# EAGLE design rf9.1 (EAGLE 7.4.0)
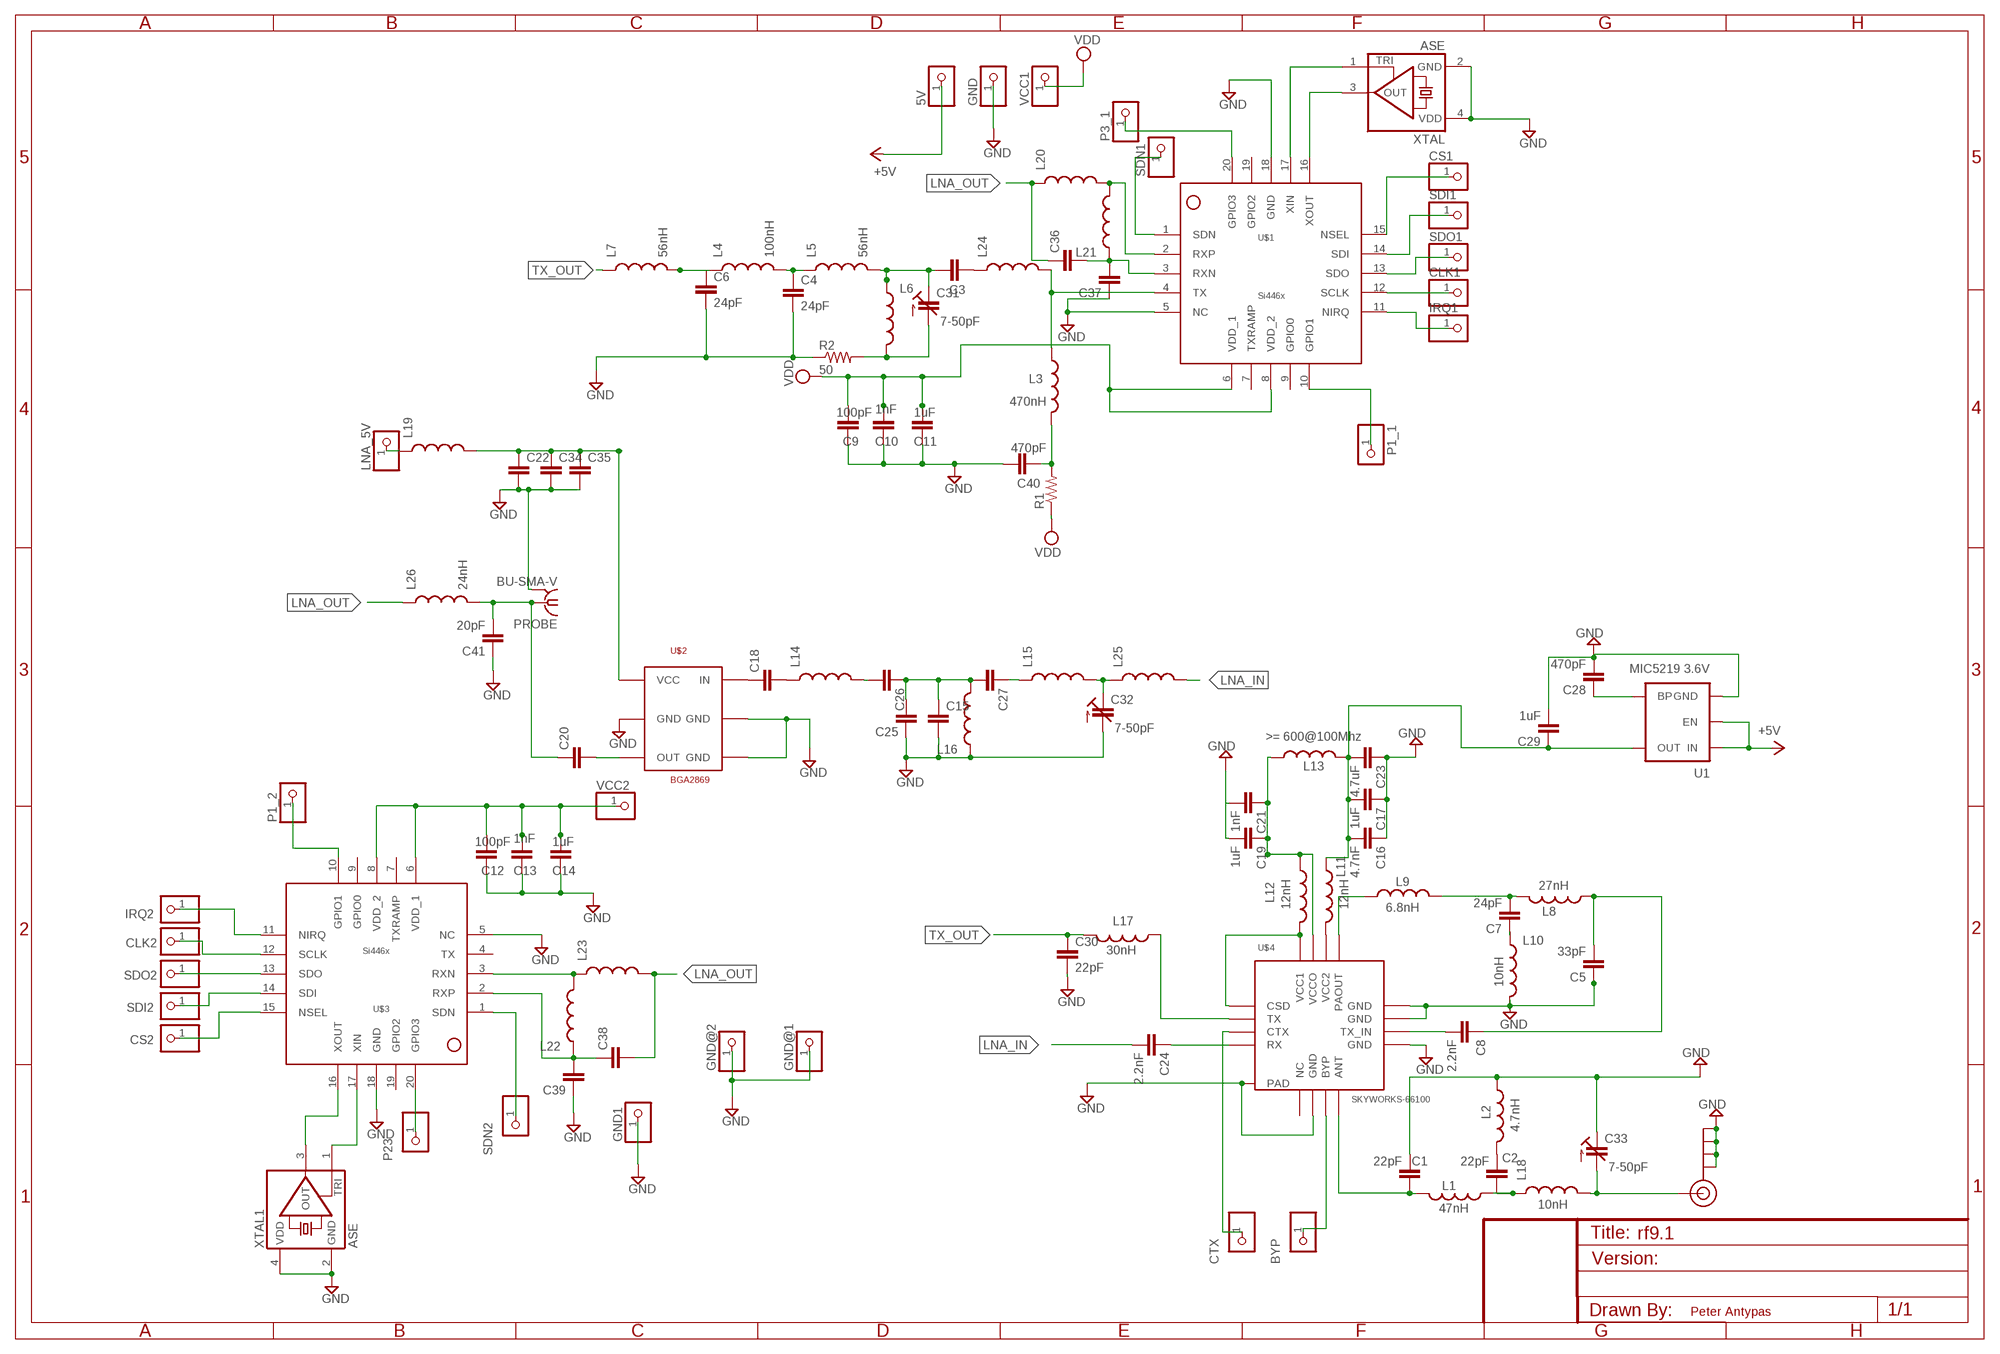
[diagram p0: schematic, sheet 1]

## Parts
5V  PINHD-1X1  [1X01]
BYP  PINHD-1X1  [1X01]
C1  22pF  CAP0603-CAP  [0603-CAP]
C2  22pF  CAP0603-CAP  [0603-CAP]
C3  CAP0603-CAP  [0603-CAP]
C4  24pF  CAP0603-CAP  [0603-CAP]
C5  33pF  CAP0603-CAP  [0603-CAP]
C6  24pF  CAP0603-CAP  [0603-CAP]
C7  24pF  CAP0603-CAP  [0603-CAP]
C8  2.2nF  CAP0603-CAP  [0603-CAP]
C9  100pF  CAP0603-CAP  [0603-CAP]
C10  1nF  CAP0603-CAP  [0603-CAP]
C11  1uF  CAP0603-CAP  [0603-CAP]
C12  100pF  CAP0603-CAP  [0603-CAP]
C13  1nF  CAP0603-CAP  [0603-CAP]
C14  1uF  CAP0603-CAP  [0603-CAP]
C15  CAP0603-CAP  [0603-CAP]
C16  4.7nF  CAP0805  [0805]
C17  1uF  CAP0805  [0805]
C18  CAP0805  [0805]
C19  1uF  CAP0805  [0805]
C20  CAP0805  [0805]
C21  1nF  CAP0805  [0805]
C22  CAP0603-CAP  [0603-CAP]
C23  4.7uF  CAP0805  [0805]
C24  2.2nF  CAP0805  [0805]
C25  CAP0603-CAP  [0603-CAP]
C26  CAP0603-CAP  [0603-CAP]
C27  CAP0603-CAP  [0603-CAP]
C28  470pF  CAP0603-CAP  [0603-CAP]
C29  1uF  CAP0805  [0805]
C30  22pF  CAP0603-CAP  [0603-CAP]
C31  7-50pF  C-TRIMMTZBX4  [CTRIMTZBX4]
C32  7-50pF  C-TRIMMTZBX4  [CTRIMTZBX4]
C33  7-50pF  C-TRIMMTZBX4  [CTRIMTZBX4]
C34  CAP0603-CAP  [0603-CAP]
C35  CAP0603-CAP  [0603-CAP]
C36  CAP0603-CAP  [0603-CAP]
C37  CAP0603-CAP  [0603-CAP]
C38  CAP0603-CAP  [0603-CAP]
C39  CAP0603-CAP  [0603-CAP]
C40  470pF  CAP0603-CAP  [0603-CAP]
C41  20pF  CAP0603-CAP  [0603-CAP]
CLK1  PINHD-1X1  [1X01]
CLK2  PINHD-1X1  [1X01]
CS1  PINHD-1X1  [1X01]
CS2  PINHD-1X1  [1X01]
CTX  PINHD-1X1  [1X01]
GND  PINHD-1X1  [1X01]
GND1  PINHD-1X1  [1X01]
GND@1  PINHD-1X1  [1X01]
GND@2  PINHD-1X1  [1X01]
IRQ1  PINHD-1X1  [1X01]
IRQ2  PINHD-1X1  [1X01]
J$1  SMA_EDGE  [SMA-EDGE]
L1  47nH  INDUCTOR30OHM,1.8A  [0603]
L2  4.7nH  INDUCTOR30OHM,1.8A  [0603]
L3  470nH  INDUCTOR0805  [0805]
L4  100nH  INDUCTOR30OHM,1.8A  [0603]
L5  56nH  INDUCTOR30OHM,1.8A  [0603]
L6  INDUCTOR30OHM,1.8A  [0603]
L7  56nH  INDUCTOR30OHM,1.8A  [0603]
L8  27nH  INDUCTOR30OHM,1.8A  [0603]
L9  6.8nH  INDUCTOR30OHM,1.8A  [0603]
L10  10nH  INDUCTOR30OHM,1.8A  [0603]
L11  12nH  INDUCTOR30OHM,1.8A  [0603]
L12  12nH  INDUCTOR30OHM,1.8A  [0603]
L13  >= 600@100Mhz  INDUCTOR30OHM,1.8A  [0603]
L14  INDUCTOR30OHM,1.8A  [0603]
L15  INDUCTOR30OHM,1.8A  [0603]
L16  INDUCTOR30OHM,1.8A  [0603]
L17  30nH  INDUCTOR30OHM,1.8A  [0603]
L18  10nH  INDUCTOR30OHM,1.8A  [0603]
L19  INDUCTOR30OHM,1.8A  [0603]
L20  INDUCTOR30OHM,1.8A  [0603]
L21  INDUCTOR30OHM,1.8A  [0603]
L22  INDUCTOR30OHM,1.8A  [0603]
L23  INDUCTOR30OHM,1.8A  [0603]
L24  INDUCTOR30OHM,1.8A  [0603]
L25  INDUCTOR30OHM,1.8A  [0603]
L26  24nH  INDUCTOR30OHM,1.8A  [0603]
LNA_5V  PINHD-1X1  [1X01]
P1_1  PINHD-1X1  [1X01]
P1_2  PINHD-1X1  [1X01]
P3_1  PINHD-1X1  [1X01]
P23  PINHD-1X1  [1X01]
PROBE  BU-SMA-V  [BU-SMA-V]
R1  RESISTOR0603-RES  [0603-RES]
R2  50  RESISTOR0603-RES  [0603-RES]
SDI1  PINHD-1X1  [1X01]
SDI2  PINHD-1X1  [1X01]
SDN1  PINHD-1X1  [1X01]
SDN2  PINHD-1X1  [1X01]
SDO1  PINHD-1X1  [1X01]
SDO2  PINHD-1X1  [1X01]
U1  MIC5219 3.6V  V_REG_MIC52193.3V  [SOT23-5]
U$1  SI4463  [SI4463]
U$2  BGA2869  [SOT363]
U$3  SI4463  [SI4463]
U$4  SKYWORKS-66100  [MCM16]
VCC1  PINHD-1X1  [1X01]
VCC2  PINHD-1X1  [1X01]
XTAL  ASE  [ASE]
XTAL1  ASE  [ASE]

## Nets
+5V: 5V.1 U1.1(IN) U1.3(EN)
CS: CS1.1 U$1.15(NSEL)
GND: C1.2 C4.2 C5.1 C6.2 C9.2 C10.2 C11.2 C12.2 C13.2 C14.2 C15.2 C16.1 C17.1 C19.2 C21.2 C22.2 C23.1 C25.1 C28.2 C29.2 C30.2 C32.2(A) C33.1(E) C34.2 C35.2 C37.1 C39.1 C40.2 C41.1 GND1.1 GND.1 GND@1.1 GND@2.1 J$1.GND@0(GND) J$1.GND@1(GND) J$1.GND@2(GND) J$1.GND@3(GND) L2.1 L10.2 L16.1 PROBE.2 PROBE.3 PROBE.4 PROBE.5 R2.1 U1.2(GND) U$1.5(NC) U$1.18(GND) U$2.2(GND) U$2.4(GND) U$2.5(GND) U$3.5(NC) U$3.18(GND) U$4.P$6(GND) U$4.P$9(GND) U$4.P$11(GND) U$4.P$12(GND) U$4.P$17(PAD) XTAL1.2(GND) XTAL1.4(VDD) XTAL.2(GND) XTAL.4(VDD)
IRQ2: IRQ2.1 U$3.11(NIRQ)
LNA_5V: C22.1 C34.1 C35.1 L19.2 U$2.1(VCC)
LNA_IN: C24.2 L25.2
LNA_OUT: C36.1 C38.2 L20.1 L23.2 L26.1
N$1: C2.1 L1.1 L18.1
N$2: C1.1 L1.2 U$4.P$8(ANT)
N$3: C4.1 L4.2 L5.1
N$4: C6.1 L4.1 L7.2
N$5: P23.1 U$3.20(GPIO3)
N$6: L3.1 L24.2 U$1.4(TX)
N$7: U$1.17(XIN) XTAL.1(TRI)
N$8: C2.2 L2.2
N$9: C8.2 U$4.P$10(TX_IN)
N$10: P1_2.1 U$3.10(GPIO1)
N$11: C5.2 C8.1 L8.1
N$12: C7.2 L8.2 L9.2
N$13: U$1.16(XOUT) XTAL.3(OUT)
N$14: C18.1 U$2.6(IN)
N$15: C18.2 L14.1
N$16: C20.2 U$2.3(OUT)
N$17: C7.1 L10.1
N$18: C31.2(A) L6.2 R2.2
N$19: L9.1 U$4.P$13(PAOUT)
N$20: C3.2 C31.1(E) L5.2 L6.1
N$21: C19.1 C21.1 L12.1 L13.1 U$4.P$15(VCCO)
N$22: L12.2 U$4.P$1(CSD) U$4.P$16(VCC1)
N$23: C24.1 U$4.P$4(RX)
N$24: IRQ1.1 U$1.11(NIRQ)
N$25: BYP.1 U$4.P$7(BYP)
N$26: CTX.1 U$4.P$3(CTX)
N$27: C28.1 U1.4(BP)
N$30: C16.2 C17.2 C23.2 C29.1 L11.1 L13.2 U1.5(OUT)
N$31: SDI2.1 U$3.14(SDI)
N$32: CS2.1 U$3.15(NSEL)
N$33: L11.2 U$4.P$14(VCC2)
N$34: C15.1 C25.2 C26.1 C27.2 L16.2
N$35: C27.1 L15.1
N$36: C26.2 L14.2
N$37: SDN1.1 U$1.1(SDN)
N$38: U$3.17(XIN) XTAL1.1(TRI)
N$39: U$3.16(XOUT) XTAL1.3(OUT)
N$40: SDN2.1 U$3.1(SDN)
N$41: SDO2.1 U$3.13(SDO)
N$42: L17.1 U$4.P$2(TX)
N$43: C33.2(A) J$1.SIG(SIGNAL) L18.2
N$44: CLK2.1 U$3.12(SCLK)
N$45: L19.1 LNA_5V.1
N$46: L20.2 L21.2 U$1.2(RXP)
N$47: L22.2 L23.1 U$3.3(RXN)
N$48: C38.1 C39.2 L22.1 U$3.2(RXP)
N$49: C36.2 C37.2 L21.1 U$1.3(RXN)
N$50: C40.1 L3.2 R1.2
N$51: C3.1 L24.1
N$52: C32.1(E) L15.2 L25.1
N$53: C20.1 C41.2 L26.2 PROBE.1
SCLK: CLK1.1 U$1.12(SCLK)
SCLK2: P1_1.1 U$1.10(GPIO1)
SCLK3: P3_1.1 U$1.20(GPIO3)
SDI: SDI1.1 U$1.14(SDI)
SDO: SDO1.1 U$1.13(SDO)
TX_OUT: C30.1 L7.1 L17.2
VCC2: C12.1 C13.1 C14.1 U$3.6(VDD_1) U$3.8(VDD_2) VCC2.1
VDD: C9.1 C10.1 C11.1 R1.1 U$1.6(VDD_1) U$1.8(VDD_2) VCC1.1
Unconnected: U$1.7(TXRAMP) U$1.9(GPIO0) U$1.19(GPIO2) U$3.4(TX) U$3.7(TXRAMP) U$3.9(GPIO0) U$3.19(GPIO2) U$4.P$5(NC)

## Notes on the sheet
- Peter Antypas

## Library data of the parts
5V BYP CLK1 CLK2 CS1 CS2 CTX GND GND1 GND@1 GND@2 IRQ1 IRQ2 LNA_5V P1_1 P1_2 P3_1 P23 SDI1 SDI2 SDN1 SDN2 SDO1 SDO2 VCC1 VCC2 = pinhead:PINHD-1X1: PIN HEADER
C1-C17 C19 C21-C30 C34-C41 = SparkFun-Capacitors:CAP: Capacitor Standard 0603 ceramic capacitor, and 0.1" leaded capacitor.
C18 C20 = SparkFun-Passives:CAP: Capacitor Standard 0603 ceramic capacitor, and 0.1" leaded capacitor.
C31-C33 = rcl:C-TRIMM: Trimm capacitor
J$1 = SparkFun-Connectors:SMA_EDGE: SMA Antenna Connector End launch SMA connector. The paste layer has been removed so that the connector can be hand soldered onto the board after reflow.
L1 L2 L4-L26 = SparkFun-Passives:INDUCTOR: Inductors Basic Inductor/Choke - 0603 and 1206. Footprints are not proven and vary greatly between part numbers. INDUCTOR POWER 3.3UH 4.0A SMD 0.197" L x 0.197" W x 0.177" H (5.00mm x 5.00mm x 4.50mm); PROD_ID: RES-07859
L3 = SparkFun-Passives:INDUCTOR: Inductors Basic Inductor/Choke - 0603 and 1206. Footprints are not proven and vary greatly between part numbers. INDUCTOR POWER 3.3UH 4.0A SMD 0.197" L x 0.197" W x 0.177" H (5.00mm x 5.00mm x 4.50mm)
PROBE = con-coax:BU-SMA-V: FEMALE SMA CONNECTOR Radiall distributor RS 112-3794; OC_FARNELL: unknown; OC_NEWARK: unknown
R1 R2 = SparkFun-Passives:RESISTOR: Resistor Basic schematic elements and footprints for 0603, 1206, and PTH resistors.
U1 = SparkFun-PowerIC:V_REG_MIC5219: V_REG MIC5219 Standard 3.3V and 5V 500mA LDO voltage regulator in SOT-23 layout. Micrel part MIC5219. BP (by-pass) pin is used to lower output noise with 470pF cap, may be left open.; PROD_ID: VREG-09872; VALUE: MIC5219 3.3V
U$1 U$3 = EZRadioPRO:SI4463
U$2 = nxp:BGA2869
U$4 = skyworks:SKYWORKS-66100: Skyworks 66100 front end module for 169-170Mhz
XTAL XTAL1 = crystal:ASE: 3.3Vdc CMOS SMD CRYSTAL CLOCK OSCILLATOR SOurce: www.abracon.com; OC_FARNELL: unknown; OC_NEWARK: unknown

## Board
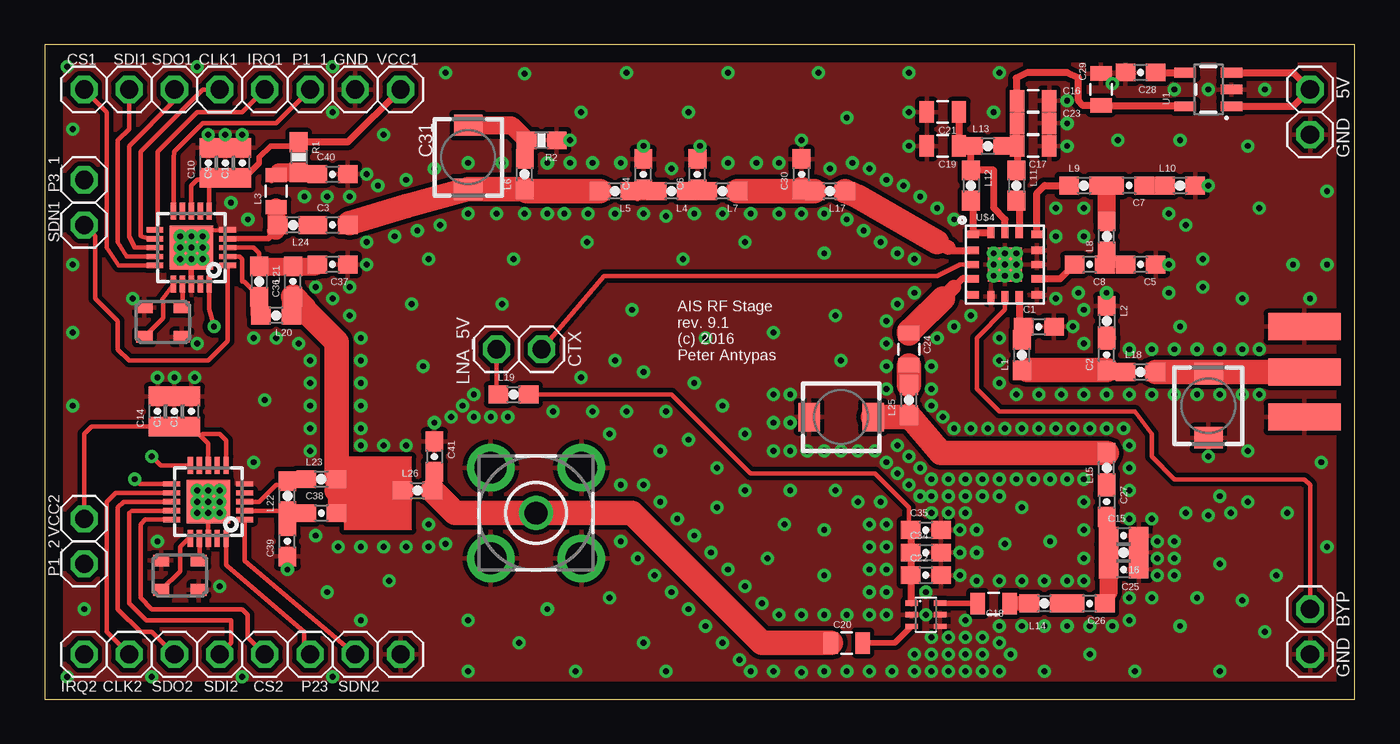
[diagram p1: board, top side]
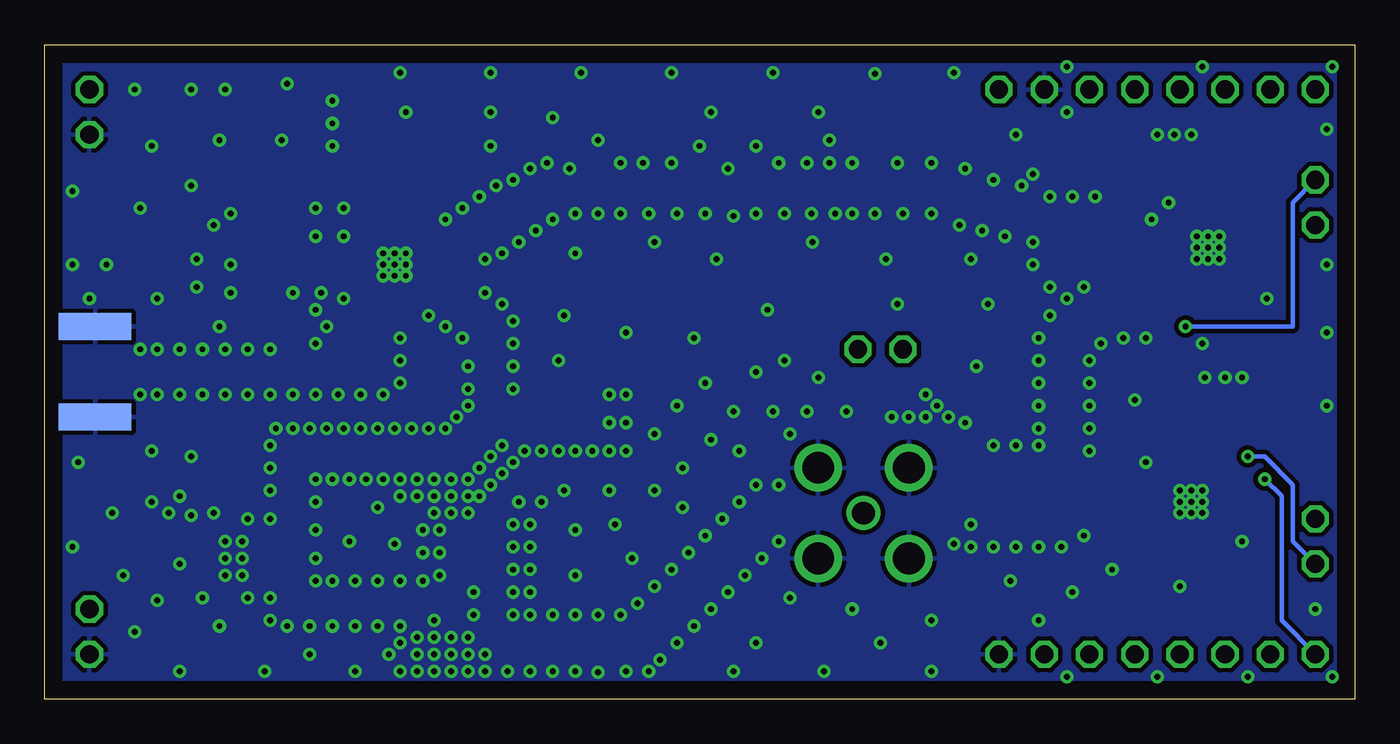
[diagram p2: board, bottom side, seen from below]

Size 73.65 x 36.82 mm. Coordinates in mm from the lower left corner, seen from the top.
Outline: 0,0 73.65,0 73.65,36.82 0,36.82 0,0
Copper layers (1*16): Top 0.035mm / dielectric 1.5mm / Bottom 0.035mm
Design rules "default *": minimum track width 10mil, minimum drill 24mil, track to track 8mil, track to pad 8mil, pad to pad 8mil, via to via 8mil, smd to smd 8mil, copper to edge 40mil, drill to drill 8mil, minimum pad ring 10mil, minimum via ring 8mil, stop-mask expansion 4mil, vias tented up to drill 10mm, thermal gap 10mil

### Footprints (pad centres in the part's own frame; a part is rotated, then mirrored left to right if it is on the bottom)
1X01 = drill 1.016 octagon: 1 0,0
0603-CAP = smd 1.1 x 1: 1 -0.85,0; 2 0.85,0
0805 = smd 0.8 x 1.2: 1 -0.9,0; 2 0.9,0
CTRIMTZBX4 = smd 1.6 x 1.2: 1 0,1.8; 2 0,-1.8
SMA-EDGE = smd 1.524 x 4.064: GND@0 0,0; GND@1 5.08,0; SIG 2.54,0 | smd 1.524 x 4.064 bottom: GND@2 0,0; GND@3 5.08,0
0603 = smd 1.1 x 1: 1 -0.85,0; 2 0.85,0
BU-SMA-V = drill 1.27: 1 0,0 | drill 1.778: 2 -2.55,2.55; 3 2.55,2.55; 4 2.55,-2.55; 5 -2.55,-2.55
0603-RES = smd 1.1 x 1: 1 -0.85,0; 2 0.85,0
SOT23-5 = smd 0.55 x 1.2: 1 -0.95,-1.3; 2 0,-1.3; 3 0.95,-1.3; 4 0.95,1.3; 5 -0.95,1.3
SI4463 = smd 0.95 x 0.3: 1 -2.05,1; 2 -2.05,0.5; 3 -2.05,0; 4 -2.05,-0.5; 5 -2.05,-1; 11 2.05,-1; 12 2.05,-0.5; 13 2.05,0; 14 2.05,0.5; 15 2.05,1 | smd 0.3 x 0.95: 6 -1,-2.05; 7 -0.5,-2.05; 8 0,-2.05; 9 0.5,-2.05; 10 1,-2.05; 16 1,2.05; 17 0.5,2.05; 18 0,2.05; 19 -0.5,2.05; 20 -1,2.05 | smd 2.45 x 2.45: EXP 0,0
SOT363 = smd 0.3 x 0.7: 1 -0.65,-0.8; 2 0,-0.8; 3 0.65,-0.8; 4 0.65,0.8; 5 0,0.8; 6 -0.65,0.8
MCM16 = smd 0.65 x 0.4: P$1 -1.8,1.7; P$2 -1.8,0.8; P$3 -1.8,0; P$4 -1.8,-0.8; P$5 -1.8,-1.7; P$9 1.8,-1.7; P$10 1.8,-0.8; P$11 1.8,0; P$12 1.8,0.8; P$13 1.8,1.7 | smd 0.4 x 0.65: P$6 -0.8,-1.8; P$7 0,-1.8; P$8 0.8,-1.8; P$14 0.8,1.8; P$15 0,1.8; P$16 -0.8,1.8 | smd 1.9 x 1.9: P$17 0,0
ASE = smd 0.9 x 0.65: 1 -1.05,-0.825; 2 1.05,-0.825; 3 1.05,0.825; 4 -1.05,0.825

### Placement (x,y rotation side)
5V  71.12,34.29 0 top
BYP  71.12,5.08 0 top
C1  55.88,20.95 0 top
C2  59.69,19.37 90 top
C3  16.19,26.67 0 top
C4  33.66,29.53 90 top
C5  61.59,24.45 180 top
C6  36.69,29.53 90 top
C7  60.96,28.89 180 top
C8  58.74,24.45 180 top
C9  10.16,30.16 90 top
C10  9.21,30.16 90 top
C11  11.11,30.16 90 top
C12  8.26,16.19 90 top
C13  7.3,16.19 90 top
C14  6.35,16.19 90 top
C15  60.64,9.21 0 top
C16  55.56,33.66 180 top
C17  55.56,31.11 180 top
C18  53.34,5.4 0 top
C19  50.48,31.11 180 top
C20  45.09,3.17 0 top
C21  50.48,33.02 180 top
C22  49.53,6.99 0 top
C23  55.56,32.38 180 top
C24  48.58,19.68 270 top
C25  60.64,7.3 180 top
C26  58.74,5.4 180 top
C27  59.69,11.11 270 top
C28  61.59,35.24 180 top
C29  59.37,34.29 90 top
C30  42.55,29.53 90 top
C31  23.81,30.48 180 top
C32  44.77,15.88 270 top
C33  65.41,16.51 180 top
C34  49.53,8.26 0 top
C35  49.53,9.53 0 top
C36  13.97,23.5 90 top
C37  16.19,24.45 180 top
C38  15.56,10.48 0 top
C39  13.65,8.89 90 top
C40  16.19,29.53 0 top
C41  21.91,13.65 270 top
CLK1  9.84,34.29 0 top
CLK2  4.76,2.54 0 top
CS1  2.22,34.29 0 top
CS2  12.38,2.54 0 top
CTX  27.94,19.68 0 top
GND  17.46,34.29 0 top
GND1  71.12,31.75 0 top
GND@1  71.12,2.54 0 top
GND@2  20,2.54 0 top
IRQ1  12.38,34.29 0 top
IRQ2  2.22,2.54 0 top
J$1  70.8,15.88 90 top
L1  54.93,19.37 90 top
L2  59.69,21.27 270 top
L3  13.02,28.57 90 top
L4  35.24,28.57 180 top
L5  32.07,28.57 180 top
L6  26.99,29.53 90 top
L7  38.1,28.57 180 top
L8  59.69,26.04 90 top
L9  58.42,28.89 0 top
L10  63.82,28.89 0 top
L11  54.61,28.89 270 top
L12  52.07,28.89 270 top
L13  53.02,31.11 0 top
L14  56.2,5.4 0 top
L15  59.69,13.02 90 top
L16  60.64,8.26 180 top
L17  44.13,28.57 180 top
L18  61.59,18.41 0 top
L19  26.35,17.14 0 top
L20  13.02,21.59 180 top
L21  12.06,23.5 270 top
L22  13.65,11.43 90 top
L23  15.56,12.38 0 top
L24  13.97,26.67 180 top
L25  48.58,16.83 90 top
L26  20.95,11.75 0 top
LNA_5V  25.4,19.68 0 top
P1_1  14.92,34.29 0 top
P1_2  2.22,7.62 0 top
P3_1  2.22,29.21 0 top
P23  14.92,2.54 0 top
PROBE  27.62,10.48 0 top
R1  14.29,30.48 270 top
R2  27.94,31.43 180 top
SDI1  4.76,34.29 0 top
SDI2  9.84,2.54 0 top
SDN1  2.22,26.67 0 top
SDN2  17.46,2.54 0 top
SDO1  7.3,34.29 0 top
SDO2  7.3,2.54 0 top
U1  65.41,34.29 90 top
U$1  8.26,25.4 180 top
U$2  49.53,4.76 270 top
U$3  9.21,11.11 180 top
U$4  53.98,24.45 0 top
VCC1  20,34.29 0 top
VCC2  2.22,10.16 0 top
XTAL  6.67,21.21 180 top
XTAL1  7.62,6.99 180 top

### Tracks (layer width: path | path; a pad name or v marks a point on that pad's centre or on a via)
+5V
  Top 0.406: U1.3 70.17,35.24 5V.1 70.17,33.34 U1.1
CS
  Top 0.254: CS1.1 3.49,33.02 3.49,25.4 4.17,24.4 U$1.15
GND  (via drill 0.33)
  Top 0.254: v8.89,26.04 8.89,26.35 9.4,26.35 U$1.5 | U$3.18 v9.21,10.48 v9.84,10.48 9.98,10.61
  Top 0.305: U$1.18 8.26,24.45 v7.62,24.77
  other vias: 64.14,10.48 38.42,35.24 26.99,35.18 45.09,32.7 30.48,25.72 8.89,24.77 30.8,30.16 67.31,5.58 47.31,20 16.19,22.54 51.44,8.26 48.58,31.11 50.16,27.62 53.66,6.67 18.1,25.72 8.45,18.1 14.92,15.24 4.95,22.54 48.9,24.77 9.21,31.75 22.54,35.24 45.4,30.16 33.02,21.91 51.44,9.53 62.55,7.94 39.69,27.3 47.94,25.08 36.51,9.21 28.26,30.16 26.99,27.3 15.88,28.26 17.14,28.26 35.88,24.77 25.72,22.23 23.81,27.3 46.04,26.35 7.62,26.04 60.96,13.02 29.53,31.43 17.14,23.18 34.92,27.18 10.48,27.94 28.26,27.3 29.53,30.16 33.66,31.11 49.85,1.59 19.05,31.75 47.31,18.73 48.58,33.02 10.16,31.75 47.31,6.03 47.31,21.27 54.93,6.67 45.09,26.99 1.59,24.45 30.54,27.3 52.7,3.49 60.96,11.75 25.4,27.3 39.37,25.72 49.53,4.76 52.07,21.59 49.85,3.49 38.42,30.16 35.24,29.84 50.16,20.32 15.88,6.03 17.78,17.78 6.35,18.1 11.43,26.99 16.51,8.57 20.95,26.35 58.42,11.11 2.22,5.08 58.42,7.94 60.96,14.29 13.02,20.32 47.31,29.21 17.14,21.59 48.58,35.24 11.75,13.34 42.55,1.52 18.1,24.45 15.24,9.21 22.54,8.75 65.41,10.34 53.98,8.75 22.23,26.67 29.21,27.3 63.18,24.45 57.78,20.95 49.21,28.26 64.14,26.67 60.96,10.16 53.66,19.05 51.75,3.49 53.66,20.32 53.34,24.45 40.01,30.16 43.81,27.3 41.27,30.16 41.27,27.3 46.99,25.72 48.26,28.89 18.73,28.89 8.57,11.75 9.84,11.75 8.57,10.48 62.55,6.99 17.78,16.51 16.19,33.02 45.09,4.76 50.8,3.49 49.85,2.54 39.69,1.59 17.78,20.32 21.91,15.56 14.92,13.97 17.78,15.24 52.7,2.54 52.39,6.67 38.1,27.3 36.2,33.02 13.65,7.3 14.92,19.05 7.3,18.1 50.8,2.54 36.51,27.3 42.55,31.43 44.13,29.84 42.55,27.3 32.07,27.3 33.66,27.3 49.85,16.51 47.94,22.23 52.7,12.38 47.31,4.76 48.9,2.54 32.7,35.24 36.83,31.11 51.12,20.95 51.12,26.99 51.75,1.59 63.82,20.95 58.42,12.38 46.35,4.76 71.12,22.54 65.09,23.18 70.17,24.45 63.5,19.68 67.31,22.54 65.41,13.65 53.98,25.08 59.69,17.14 67.31,19.68 66.04,19.68 64.77,19.68 60.96,19.68 56.83,26.04 55.88,17.14 57.15,17.14 67.63,13.97 65.09,24.77 68.26,17.14 54.93,15.24 63.18,27.3 72.07,28.57 58.42,20 65.41,28.89 54.61,23.81 68.58,34.29 54.61,24.45 58.42,27.62 71.75,13.34 53.98,24.45 72.07,24.45 45.09,1.59 17.78,19.05 51.75,2.54 48.9,22.86 49.85,18.73 51.75,4.45 14.92,17.78 58.74,2.54 46.35,29.84 64.77,5.71 66.67,10.48 63.18,22.86 49.85,17.46 51.44,6.99 69.85,10.48 67.31,17.14 64.77,17.14 62.23,17.14 58.42,21.91 60.96,17.14 56.83,22.54 56.83,27.62 53.34,25.08 63.5,17.14 8.26,25.4 9.21,11.11 53.34,23.81 62.23,19.68 58.42,26.04 59.69,15.24 66.04,17.14 52.7,1.59 62.55,8.89 15.24,23.18 14.92,16.51 43.5,35.24 23.81,1.59 37.47,8.26 48.9,1.59 53.66,1.59 54.29,2.54 66.04,1.59 54.61,25.08 68.26,19.68 69.22,6.99 53.98,23.81 11.11,31.75 1.59,20.64 1.59,16.51 1.59,32.07 32.38,30.16 19.68,26.04 8.57,20 11.75,20.32 6.35,8.89 17.78,4.45 33.66,12.06 53.66,12.38 14.61,28.26 50.8,1.59 47.62,1.59 14.29,20 21.27,18.73 17.78,8.57 20.32,14.29 21.59,24.77 18.1,29.53 21.91,29.84 23.81,30.16 25.72,30.16 53.66,17.78 58.1,22.86 59.69,22.86 35.56,10.16 63.5,8.89 62.23,10.16 63.5,7.94 63.5,6.99 34.61,11.11 62.23,5.71 60.96,5.71 60.96,4.45 60.01,4.13 58.74,4.13 50.8,12.38 51.75,12.38 56.2,6.67 53.66,3.17 67.63,11.11 53.66,4.13 57.47,4.13 56.2,4.13 58.42,9.53 56.52,8.89 58.42,6.67 19.05,8.57 33.34,7.94 34.29,6.99 35.24,6.03 36.2,5.08 37.15,4.13 38.1,3.17 16.19,35.56 1.27,1.27 43.81,25.08 43.81,1.59 46.35,1.59 38.42,7.3 39.37,6.35 40.32,5.4 42.55,4.76 43.81,4.76 37.78,10.79 37.15,20.32 54.93,4.13 54.93,10.79 43.81,9.53 47.31,9.84 47.31,8.57 47.31,7.3 46.35,9.84 46.35,8.57 46.35,7.3 46.35,6.03 58.42,17.14 54.61,17.14 66.04,11.43 47.31,17.46 50.48,15.88 51.12,15.24 52.07,15.24 53.02,15.24 53.98,15.24 58.74,15.24 55.56,12.38 41.91,17.14 41.91,15.56 41.91,13.97 12.38,16.83 20.32,8.57 34.92,1.59 28.26,5.08 23.81,4.45 8.57,35.56 20.64,22.23 32.38,12.06 1.27,35.56 23.5,16.51 29.84,1.59 24.13,15.88 33.66,3.17 6.03,1.27 11.11,1.27 16.19,1.27 19.37,6.67 31.75,5.71 26.67,3.17 39.05,2.22 30.16,33.02 26.35,24.77 21.59,9.84 26.04,15.88 32.07,19.05 32.38,8.89 40.96,1.59 41.59,9.84 43.81,6.99 47.94,14.29 34.61,13.97 31.75,14.92 41.27,4.76 40.64,7.94 38.1,16.51 40.96,20.64 44.45,21.59 44.77,19.05 54.61,12.38 57.47,6.67 60.33,31.43 63.82,31.43 67.63,31.11 68.26,27.62 66.04,7.62 63.82,4.13 68.58,3.81 72.07,8.57 53.66,35.24 53.34,33.02 57.47,33.66 57.47,32.38 57.47,31.11 60.01,34.61 63.5,34.29 65.41,34.29 56.2,1.59 61.28,1.59 42.86,13.97 44.77,13.97 46.67,13.97 48.58,13.65 49.21,13.02 47.94,12.7 48.58,12.06 49.21,11.43 46.99,11.11 45.72,11.11 49.85,12.38 56.52,12.38 57.47,12.38 55.88,15.24 56.83,15.24 57.78,15.24 60.64,15.24 43.81,13.97 45.72,13.97 47.31,13.34 49.85,11.43 50.8,11.43 51.75,11.43 52.7,11.43 53.66,11.43 49.85,10.48 50.8,10.48 51.75,10.48 52.39,9.53 52.39,8.26 28.57,16.19 30.8,16.19 32.7,16.19 34.92,16.19 36.2,14.61 37.78,13.02 39.37,11.75 41.91,11.75 44.45,11.75 30.16,18.1 33.66,18.41 36.51,17.78 39.37,14.92 40.96,13.97 40.96,15.56 40.96,17.14 49.53,6.03 17.78,14.29 19.05,14.29 20.32,29.21 9.84,6.35 24.13,17.14 22.86,15.88 25.08,15.88 21.59,8.57 8.57,11.11 9.84,11.11 9.21,11.75 8.26,26.04 8.26,24.77 7.62,25.4 8.89,25.4
  pour Bottom (isolate 0.254): 0,37.15 73.66,37.15 73.66,0 0,0
  pour Top (isolate 0.254): 0,37.15 73.66,37.15 73.66,0 0,0
IRQ2  (via drill 0.33)
  Top 0.254: v5.08,12.38 5.35,12.11 U$3.11
  Bottom 0.254: IRQ2.1 4.13,4.45 4.13,11.43 v5.08,12.38
LNA_5V
  Top 0.254: L19.2 35.24,17.14 39.69,12.7 46.67,12.7 48.58,10.79 48.58,9.63 C35.1
  Top 0.406: C35.1 C34.1 C22.1 48.68,5.46 U$2.1
LNA_IN
  Top 1.372: C24.2 L25.2
LNA_OUT
  Top 0.254: 13.87,22.54 C36.1
  Top 1.016: L20.1 13.87,22.54 | L23.2 16.41,11.75 C38.2
  Top 1.372: L23.2 16.41,20.11 14.61,21.91 14.61,22.01 C36.1 | 16.41,11.75 17.68,10.48 18.84,10.48 L26.1
N$1
  Top 0.406: L18.1 59.79,18.41 C2.1 | 55.24,18.52 L1.1
  Top 1.372: C2.1 55.24,18.52
N$2
  Top 0.406: U$4.P$8 54.77,21.21 C1.1 55.03,20.32 L1.2
N$3
  Top 0.305: C4.1 33.34,28.16 L5.1
  Top 1.016: L5.1 L4.2
N$4
  Top 0.305: L7.2 C6.1
  Top 1.016: L4.1 L7.2
N$5
  Top 0.254: P23.1 14.61,2.86 14.61,3.81 10.3,7.47 10.21,7.57 U$3.20
N$6
  Top 0.305: 13.02,26.35 12.56,25.9 U$1.4
  Top 0.406: 13.02,26.35 13.12,26.45 L24.2
  Top 1.016: L3.1 13.02,26.35
N$7
  Top 0.254: XTAL.1 7.75,22.45 U$1.17
N$8
  Top 1.016: L2.2 C2.2
N$9
  Top 0.406: U$4.P$10 57.09,23.65 C8.2
N$10  (via drill 0.33)
  Top 0.254: v6.03,13.65 6.52,13.16 U$3.10
  Bottom 0.254: P1_2.1 3.49,8.89 3.49,12.06 5.08,13.65 v6.03,13.65
N$11
  Top 0.406: C5.2 C8.1 59.59,25.08 L8.1
N$12
  Top 0.406: C7.2 L9.2 59.69,28.47
  Top 1.016: L8.2 59.69,28.47
N$13
  Top 0.254: U$1.16 6.62,22.5 6.67,22.23 6.67,21.43 XTAL.3
N$14
  Top 0.305: C18.1 52,5.41 U$2.6
N$15
  Top 0.813: C18.2 L14.1
N$16
  Top 0.305: C20.2 47.79,3.17 U$2.3
N$17
  Top 1.016: C7.1 L10.1
N$18
  Top 0.305: R2.2 27.09,30.16 L6.2
  Top 1.016: C31.2 26.24,32.28 R2.2
N$19
  Top 0.406: U$4.P$13 55.77,28.47 56.2,28.89 L9.1
N$20
  Top 0.305: 23.71,28.26 C31.1
  Top 1.016: C3.2 17.15,26.77
  Top 1.372: L6.1 | 17.15,26.77 20.32,27.73 C31.1 L6.1 | L6.1 27.09,28.57 L5.2
N$21
  Top 0.406: U$4.P$15 53.98,26.99 53.34,27.62 53.34,29.74 L12.1 52.07,31.01 L13.1 C19.1 C21.1
N$22
  Top 0.406: L12.2 52.17,27.94 U$4.P$1 52.27,26.25 U$4.P$16
N$23
  Top 0.406: U$4.P$4 51.59,23.65 51.12,23.18
  Top 0.813: 51.12,23.18 50.48,22.54
  Top 1.372: 50.48,22.54 48.9,20.95 48.58,20.69 C24.1
N$24
  Top 0.254: IRQ1.1 11.11,33.02 8.57,33.02 6.35,30.8 6.35,26.55 U$1.11
N$25
  Top 0.254: BYP.1 71.12,12.06 70.8,12.38 63.5,12.38 62.23,13.65 62.23,14.92 61.28,16.19 53.66,16.19 52.39,17.46 52.39,20.32 53.98,21.91 U$4.P$7
N$26
  Top 0.254: CTX.1 31.43,23.81 50.16,23.81 51.44,24.45 U$4.P$3
N$27
  Top 0.406: C28.1 U1.4
N$30
  Top 0.305: 54.61,33.71 C16.2
  Top 0.406: U1.5 59.42,33.34 C29.1 58.37,33.39 58.1,33.66 58.1,34.92 57.47,35.24 55.24,35.24 54.61,34.92 54.61,33.71 | C16.2 C23.2 54.61,32.33 54.61,31.11 | L13.2 54.61,31.11 | 54.61,31.11 C17.2 54.66,29.8 L11.1
N$31
  Top 0.254: SDI2.1 10.48,3.17 10.48,4.45 5.71,4.45 4.76,5.4 4.76,10.48 4.9,10.61 U$3.14
N$32
  Top 0.254: CS2.1 11.43,3.49 11.43,4.76 11.11,5.08 6.03,5.08 5.4,5.71 5.4,9.84 5.67,10.11 U$3.15
N$33
  Top 0.406: L11.2 54.77,27.88 U$4.P$14
N$34
  Top 0.406: C27.2 59.69,8.99 C15.1 L16.2 C25.2 | 59.79,6.03 C26.1
  Top 1.016: C25.2 59.79,6.03
N$35
  Top 0.406: C27.1 L15.1
N$36
  Top 0.406: C26.2 L14.2
N$37
  Top 0.254: SDN1.1 2.86,26.04 2.86,22.54 4.13,21.27 4.13,19.68 4.76,19.05 9.21,19.05 10.3,20.15 U$1.1
N$38
  Top 0.254: XTAL1.1 8.71,7.85 U$3.17
N$39
  Top 0.254: XTAL1.3 7.62,7.21 7.62,8.57 8.11,9.06 U$3.16
N$40
  Top 0.254: U$3.1 11.26,7.79 SDN2.1
N$41
  Top 0.254: SDO2.1 6.03,3.81 5.4,3.81 4.13,5.08 4.13,10.79 4.45,11.11 U$3.13
N$42
  Top 0.406: 50.8,25.4 50.95,25.25 U$4.P$2
  Top 0.813: 50.16,25.72 50.8,25.4
  Top 1.372: 50.16,25.72 45.72,28.26 L17.1
N$43
  Top 0.61: 64.03,18.41 C33.2
  Top 1.372: J$1.SIG L18.2 64.03,18.41
N$44
  Top 0.254: CLK2.1 3.49,3.81 3.49,11.11 3.99,11.61 U$3.12
N$45
  Top 0.254: LNA_5V.1 25.4,17.25 L19.1
N$46
  Top 0.254: U$1.2 10.98,24.9 11.11,24.77 11.11,23.5 11.21,23.5 L21.2 | 12.06,21.69 L20.2
  Top 1.016: L21.2 12.06,21.69
N$47
  Top 0.254: U$3.3 12.06,11.11 13.02,12.06 13.44,12.06 L22.2 14.61,12.28 L23.1
N$48
  Top 0.254: U$3.2 13.62,10.61 L22.1 | L22.1 C39.2 | L22.1 14.61,10.58 C38.1
N$49
  Top 0.254: U$1.3 11.75,25.4 12.06,25.08 L21.1 | 15.24,24.34 C37.2
  Top 1.016: L21.1 C36.2 15.24,24.34
N$50
  Top 0.406: 12.75,29.21 L3.2 13.17,29.63 | R1.2 14.39,29.53 C40.1
  Top 1.016: 13.17,29.63 R1.2
N$51
  Top 0.406: L24.1 C3.1
N$52
  Top 0.254: 59.48,14.08 L15.2
  Top 1.372: L15.2 50.37,13.87 L25.1 48.48,15.88 C32.1
N$53
  Top 0.406: C41.2 21.91,11.85 L26.2
  Top 1.372: C20.1 40.32,3.17 33.02,10.48 PROBE.1 23.07,10.48 L26.2
SCLK
  Top 0.254: CLK1.1 8.89,34.29 5.4,30.8 5.4,26.04 5.85,25.9 U$1.12
SCLK2
  Top 0.254: P1_1.1 13.02,32.38 8.89,32.38 7.3,30.8 7.25,30.43 U$1.10 7.3,27.5
SCLK3  (via drill 0.33)
  Top 0.254: v9.53,20.95 9.26,21.95 U$1.20
  Bottom 0.254: P3_1.1 3.49,27.94 3.49,20.95 v9.53,20.95
SDI
  Top 0.254: SDI1.1 4.76,32.07 4.13,31.43 4.13,25.72 4.63,24.9 U$1.14
SDO
  Top 0.254: SDO1.1 7.3,33.66 4.76,31.11 4.76,26.04 5.08,25.4 U$1.13
TX_OUT
  Top 1.372: L7.1 42.44,28.57 C30.1 42.65,28.57 L17.2
VCC2
  Top 0.254: VCC2.1 2.22,14.92 2.64,15.34 C14.1 C13.1 C12.1 8.78,14.81 | 8.78,14.81 9.21,14.39 U$3.8 | U$3.6 10.21,14.56 9.84,14.92 8.89,14.92 8.78,14.81
VDD
  Top 0.254: U$1.6 9.26,29.27 | 9.26,29.27 C10.1 9.11,29.21 8.57,29.21 8.26,28.89 U$1.8 | 9.26,29.27 10.11,29.27 C9.1 C11.1 11.28,29.48
  Top 0.305: 11.28,29.48 11.38,29.48 12.06,30.16 12.06,30.48 12.7,31.11 14.07,31.11 R1.1
  Top 0.406: VCC1.1 17.04,31.33 R1.1
(copper drawn outside any net)
  shapes: Top area x1

### Text on the board
tNames: GND | AIS RF Stage / rev. 9.1 / (c) 2016 / Peter Antypas | GND